# EAGLE schematic bp_led (EAGLE 9.3.2)
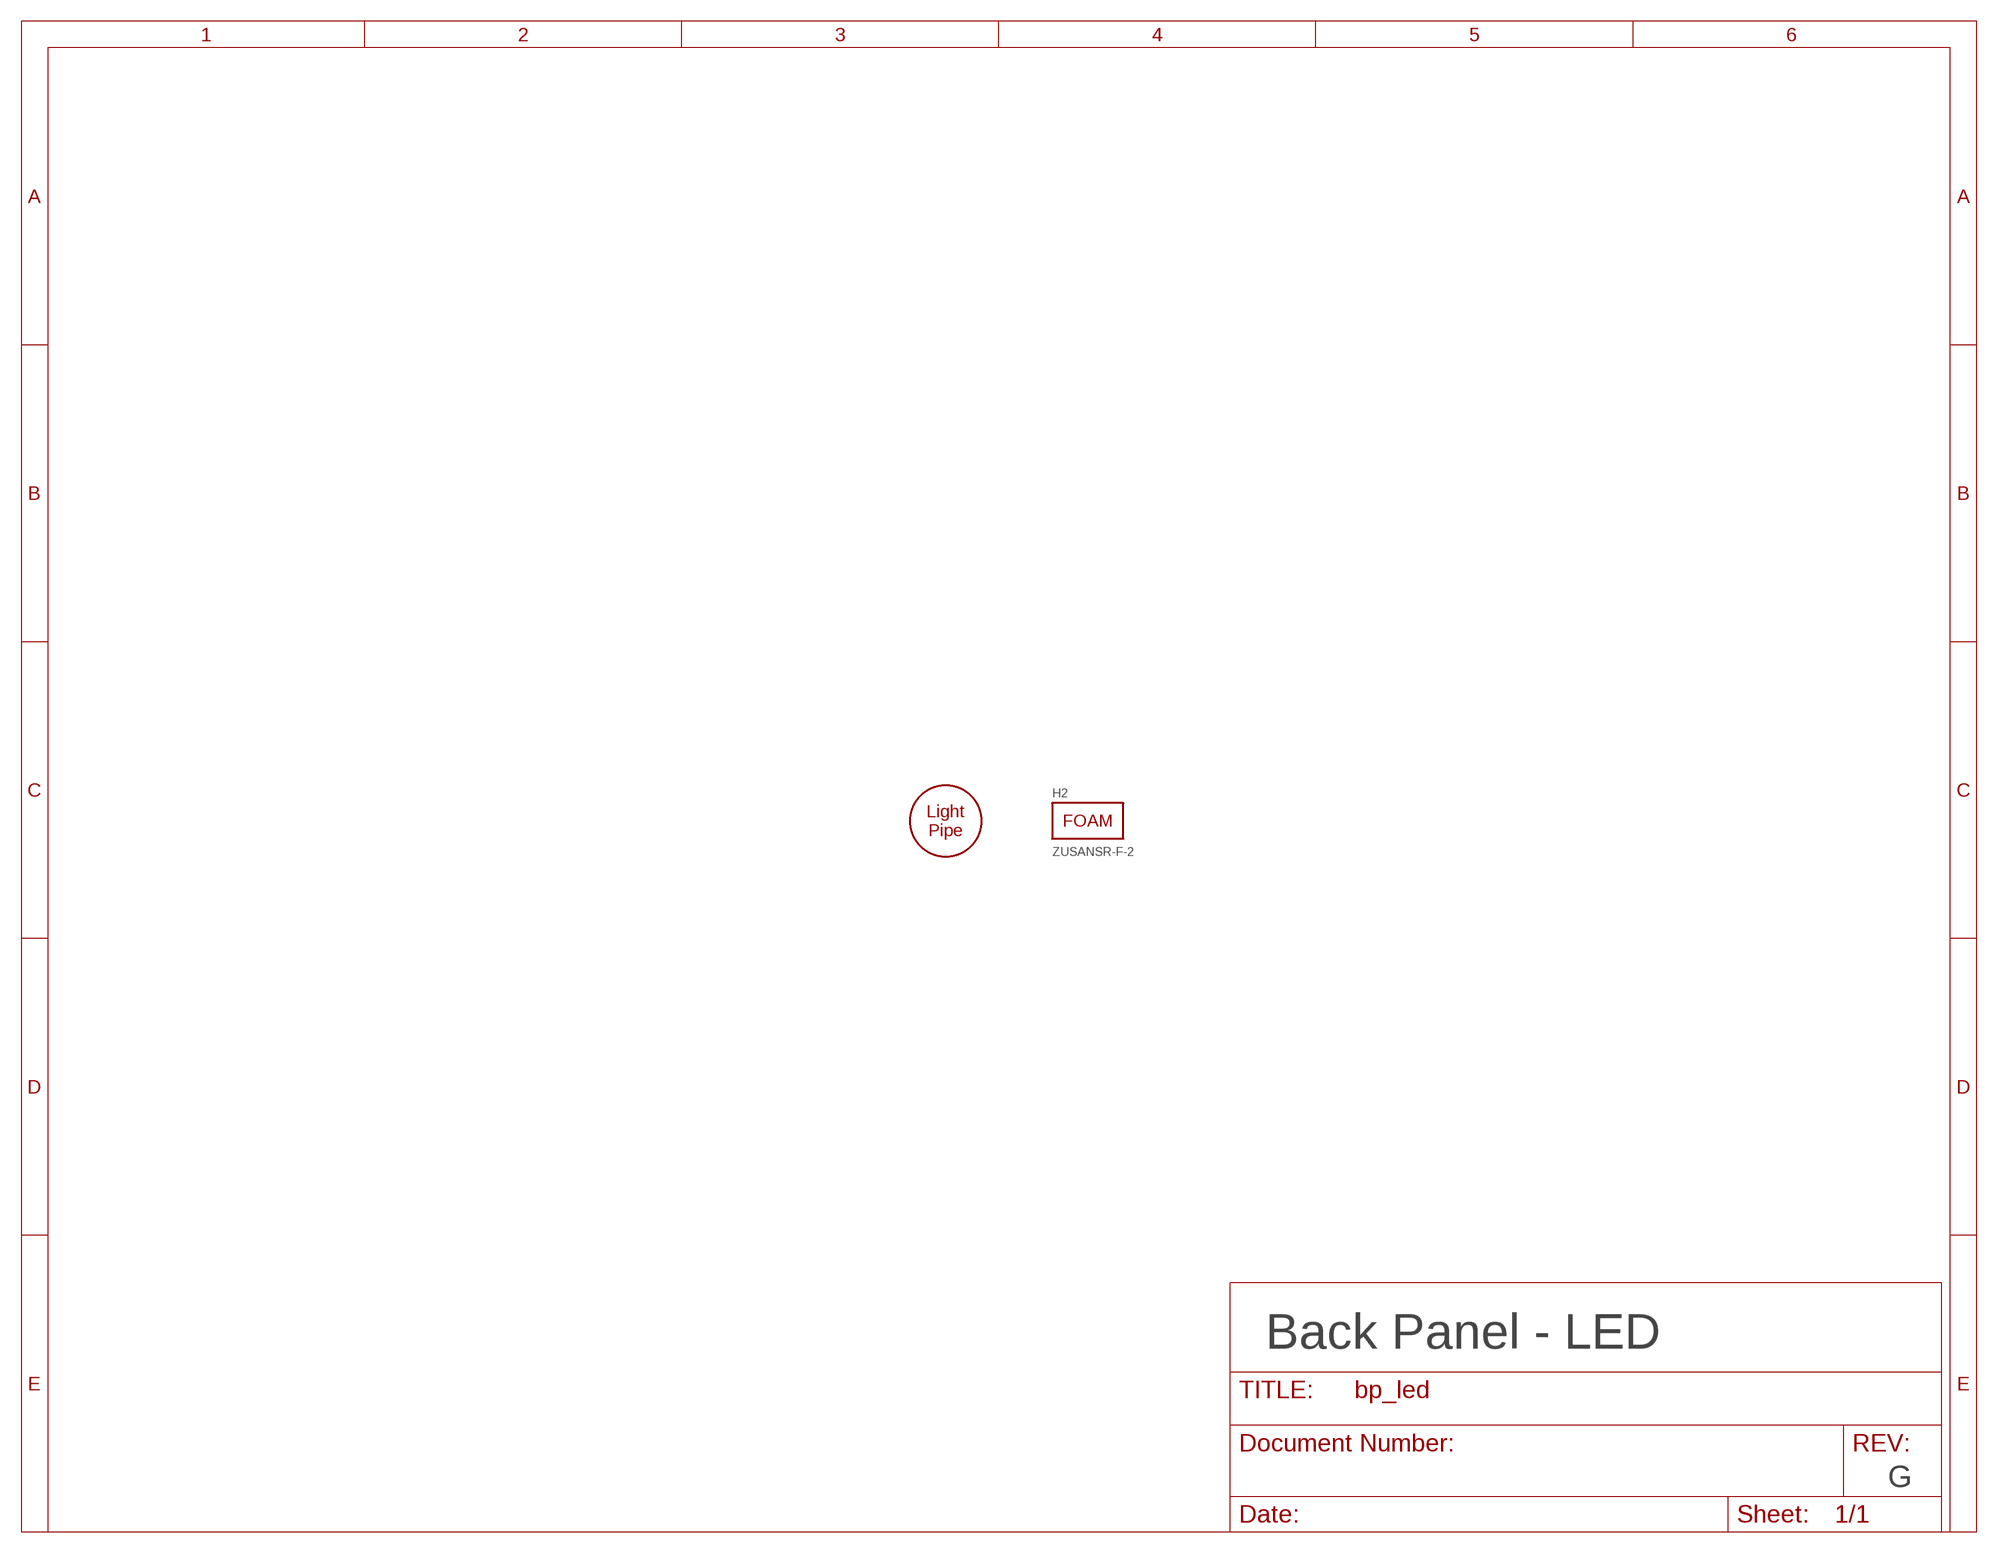
[diagram p0: schematic, sheet 1]

## Parts
H1  51513020125F  LIGHT_PIPE_PANEL_3MM  [LP_3MM]
H2  ZUSANSR-F-2  FOAM_0.5_0.25  [FOAM_0.5_0.25]

## Notes on the sheet
- Back Panel - LED
- G

## Library data of the parts
H1 = jetperch:LIGHT_PIPE; MPN: 51513020125F; POPULATE: 1
H2 = jetperch:FOAM; MPN: ZUSANSR-F-2; POPULATE: 1

## Net classes
1 USBD: width 1.016 mm, clearance 0.152 mm to class 0, clearance 0.508 mm